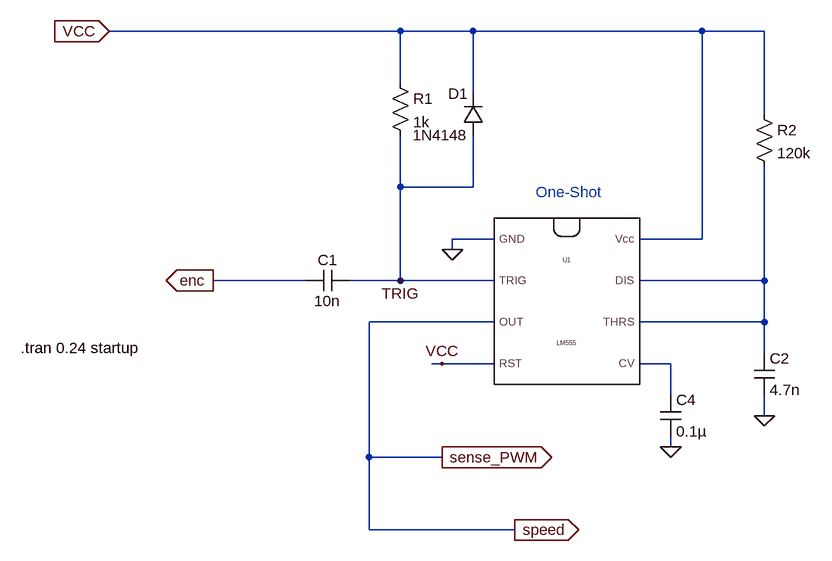
[diagram p0: schematic speed_circuit_schematic.asc]
speed_circuit_schematic.asc, the LTspice schematic file:
Version 4
SHEET 1 1188 692
WIRE 512 -224 64 -224
WIRE 624 -224 512 -224
WIRE 976 -224 624 -224
WIRE 1072 -224 976 -224
WIRE 512 -144 512 -224
WIRE 624 -128 624 -224
WIRE 1072 -96 1072 -224
WIRE 512 16 512 -64
WIRE 624 16 624 -64
WIRE 624 16 512 16
WIRE 656 96 592 96
WIRE 976 96 976 -224
WIRE 976 96 880 96
WIRE 592 112 592 96
WIRE 368 160 224 160
WIRE 512 160 512 16
WIRE 512 160 432 160
WIRE 656 160 512 160
WIRE 1072 160 1072 -16
WIRE 1072 160 880 160
WIRE 656 224 464 224
WIRE 1072 224 1072 160
WIRE 1072 224 880 224
WIRE 1072 272 1072 224
WIRE 576 288 560 288
WIRE 656 288 576 288
WIRE 928 288 880 288
WIRE 928 336 928 288
WIRE 1072 368 1072 336
WIRE 928 416 928 400
WIRE 464 432 464 224
WIRE 576 432 464 432
WIRE 464 544 464 432
WIRE 688 544 464 544
FLAG 592 112 0
FLAG 576 432 sense_PWM
IOPIN 576 432 Out
FLAG 688 544 speed
IOPIN 688 544 Out
FLAG 928 416 0
FLAG 1072 368 0
FLAG 576 288 VCC
FLAG 512 160 TRIG
FLAG 64 -224 VCC
IOPIN 64 -224 In
FLAG 224 160 enc
IOPIN 224 160 Out
SYMBOL cap 432 144 R90
WINDOW 0 0 32 VBottom 2
WINDOW 3 32 32 VTop 2
SYMATTR InstName C1
SYMATTR Value 10n
SYMBOL res 496 -160 R0
SYMATTR InstName R1
SYMATTR Value 1k
SYMBOL diode 640 -64 R180
WINDOW 0 24 64 Left 2
WINDOW 3 24 0 Left 2
SYMATTR InstName D1
SYMATTR Value 1N4148
SYMBOL LM555 768 192 R0
SYMATTR InstName U1
SYMBOL cap 912 336 R0
SYMATTR InstName C4
SYMATTR Value 0.1µ
SYMBOL cap 1056 272 R0
SYMATTR InstName C2
SYMATTR Value 4.7n
SYMBOL res 1056 -112 R0
SYMATTR InstName R2
SYMATTR Value 120k
TEXT -72 264 Left 2 !.tran 0.24 startup
TEXT 720 24 Left 2 ;One-Shot

The netlist it stands for:
* speed_circuit_schematic.asc
C1 TRIG enc 10n
R1 VCC TRIG 1k
D1 TRIG VCC 1N4148
XU1 0 TRIG speed VCC N002 N001 N001 VCC NE555  ; pins GND TRIG OUT RST CV THRS DIS Vcc
C4 N002 0 0.1µ
C2 N001 0 4.7n
R2 VCC N001 120k
.model D D
.lib standard.dio
.tran 0.24 startup
* One-Shot
.lib NE555.sub
.backanno
.end